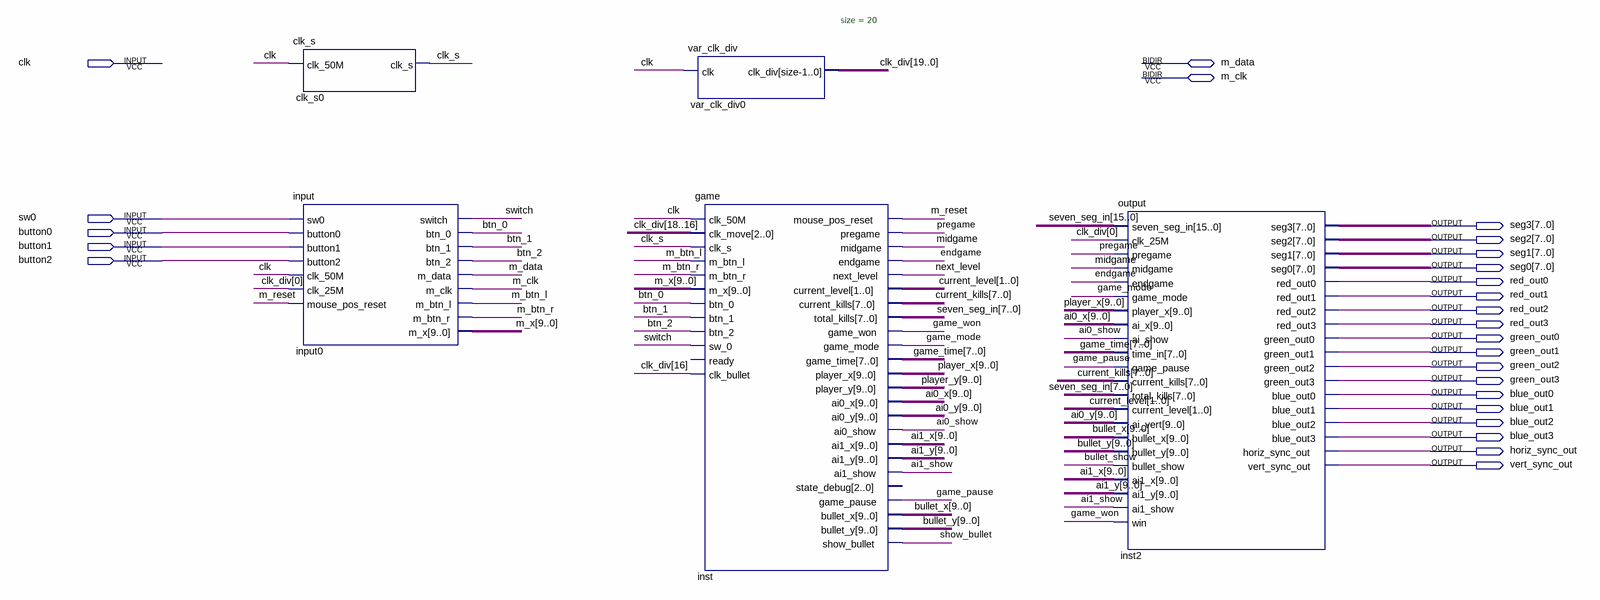
[diagram p0: schematic sheet]
// Quartus schematic tank-hunt.bdf as structural Verilog: 5 symbols, 25 pins
module \tank-hunt  (
  input  clk,
  input  sw0,
  input  button0,
  input  button1,
  input  button2,
  inout  m_data,
  inout  m_clk,
  output [7:0] seg3,
  output [7:0] seg2,
  output [7:0] seg1,
  output [7:0] seg0,
  output red_out0,
  output red_out1,
  output red_out2,
  output red_out3,
  output green_out0,
  output green_out1,
  output green_out2,
  output green_out3,
  output blue_out0,
  output blue_out1,
  output blue_out2,
  output blue_out3,
  output horiz_sync_out,
  output vert_sync_out
);

  wire ai0_show, ai1_show, btn_0, btn_1, btn_2, bullet_show, clk_s, endgame, game_mode, game_pause, game_won,
       m_btn_l, m_btn_r, m_reset, midgame, next_level, pregame, show_bullet, switch;
  wire [1:0] current_level;
  wire [7:0] current_kills, game_time;
  wire [9:0] ai0_x, ai0_y, ai1_x, ai1_y, bullet_x, bullet_y, m_x, player_x, player_y;
  wire [15:0] seven_seg_in;
  wire [19:0] clk_div;

  clk_s clk_s0 (.clk_50M(clk), .clk_s(clk_s));
  \input  input0 (
    .sw0(sw0), .button0(button0), .button1(button1), .button2(button2), .clk_50M(clk), .clk_25M(clk_div[0]),
    .mouse_pos_reset(m_reset), .switch(switch), .btn_0(btn_0), .btn_1(btn_1), .btn_2(btn_2),
    .m_btn_l(m_btn_l), .m_btn_r(m_btn_r), .m_x(m_x), .m_data(m_data), .m_clk(m_clk));
  var_clk_div #(.size(20)) var_clk_div0 (.clk(clk), .clk_div(clk_div));
  game inst (
    .clk_50M(clk), .clk_move(clk_div[18:16]), .clk_s(clk_s), .m_btn_l(m_btn_l), .m_btn_r(m_btn_r), .m_x(m_x),
    .btn_0(btn_0), .btn_1(btn_1), .btn_2(btn_2), .sw_0(switch), .clk_bullet(clk_div[16]),
    .mouse_pos_reset(m_reset), .pregame(pregame), .midgame(midgame), .endgame(endgame),
    .next_level(next_level), .current_level(current_level), .current_kills(current_kills),
    .total_kills(seven_seg_in[7:0]), .game_won(game_won), .game_mode(game_mode), .game_time(game_time),
    .player_x(player_x), .player_y(player_y), .ai0_x(ai0_x), .ai0_y(ai0_y), .ai0_show(ai0_show),
    .ai1_x(ai1_x), .ai1_y(ai1_y), .ai1_show(ai1_show), .game_pause(game_pause), .bullet_x(bullet_x),
    .bullet_y(bullet_y), .show_bullet(show_bullet));  // open: ready, state_debug
  \output  inst2 (
    .seven_seg_in(seven_seg_in), .clk_25M(clk_div[0]), .pregame(pregame), .midgame(midgame),
    .endgame(endgame), .game_mode(game_mode), .player_x(player_x), .ai_x(ai0_x), .ai_show(ai0_show),
    .time_in(game_time), .game_pause(game_pause), .current_kills(current_kills),
    .total_kills(seven_seg_in[7:0]), .current_level(current_level), .ai_vert(ai0_y), .bullet_x(bullet_x),
    .bullet_y(bullet_y), .bullet_show(bullet_show), .ai1_x(ai1_x), .ai1_y(ai1_y), .ai1_show(ai1_show),
    .win(game_won), .seg3(seg3), .seg2(seg2), .seg1(seg1), .seg0(seg0), .red_out0(red_out0),
    .red_out1(red_out1), .red_out2(red_out2), .red_out3(red_out3), .green_out0(green_out0),
    .green_out1(green_out1), .green_out2(green_out2), .green_out3(green_out3), .blue_out0(blue_out0),
    .blue_out1(blue_out1), .blue_out2(blue_out2), .blue_out3(blue_out3), .horiz_sync_out(horiz_sync_out),
    .vert_sync_out(vert_sync_out));
endmodule
